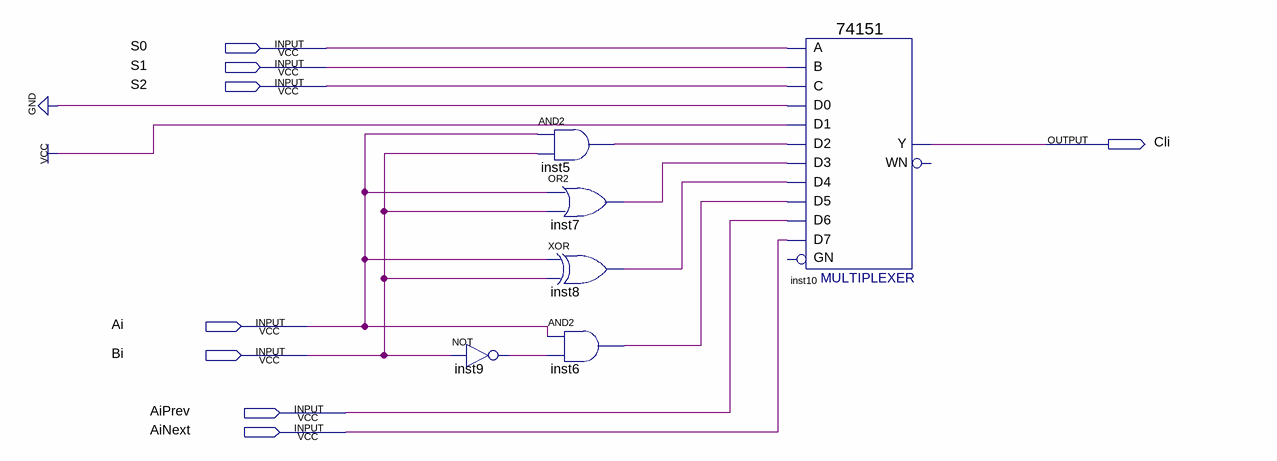
[diagram p0: schematic sheet]
// Quartus schematic logiccircuit1bit.bdf as structural Verilog: 6 symbols, 8 pins
module logiccircuit1bit (
  input  S0,
  input  S1,
  input  S2,
  input  Ai,
  input  Bi,
  input  AiPrev,
  input  AiNext,
  output Cli
);

  wire inst5_out, inst6_out, inst7_out, inst8_out, inst9_out;

  not inst9 (inst9_out, Bi);
  and inst5 (inst5_out, Ai, Bi);
  or inst7 (inst7_out, Ai, Bi);
  xor inst8 (inst8_out, Ai, Bi);
  and inst6 (inst6_out, Ai, inst9_out);
  \74151  inst10 (
    .C(S2), .B(S1), .A(S0), .D5(inst6_out), .D0(1'b0), .D1(1'b1), .D4(inst8_out), .D3(inst7_out),
    .D2(inst5_out), .D6(AiPrev), .D7(AiNext), .Y(Cli));  // open: GN, WN
endmodule
